# Altium schematic sheet MCU.SchDoc
size A2; SheetNumber: 2; SheetTotal: 10
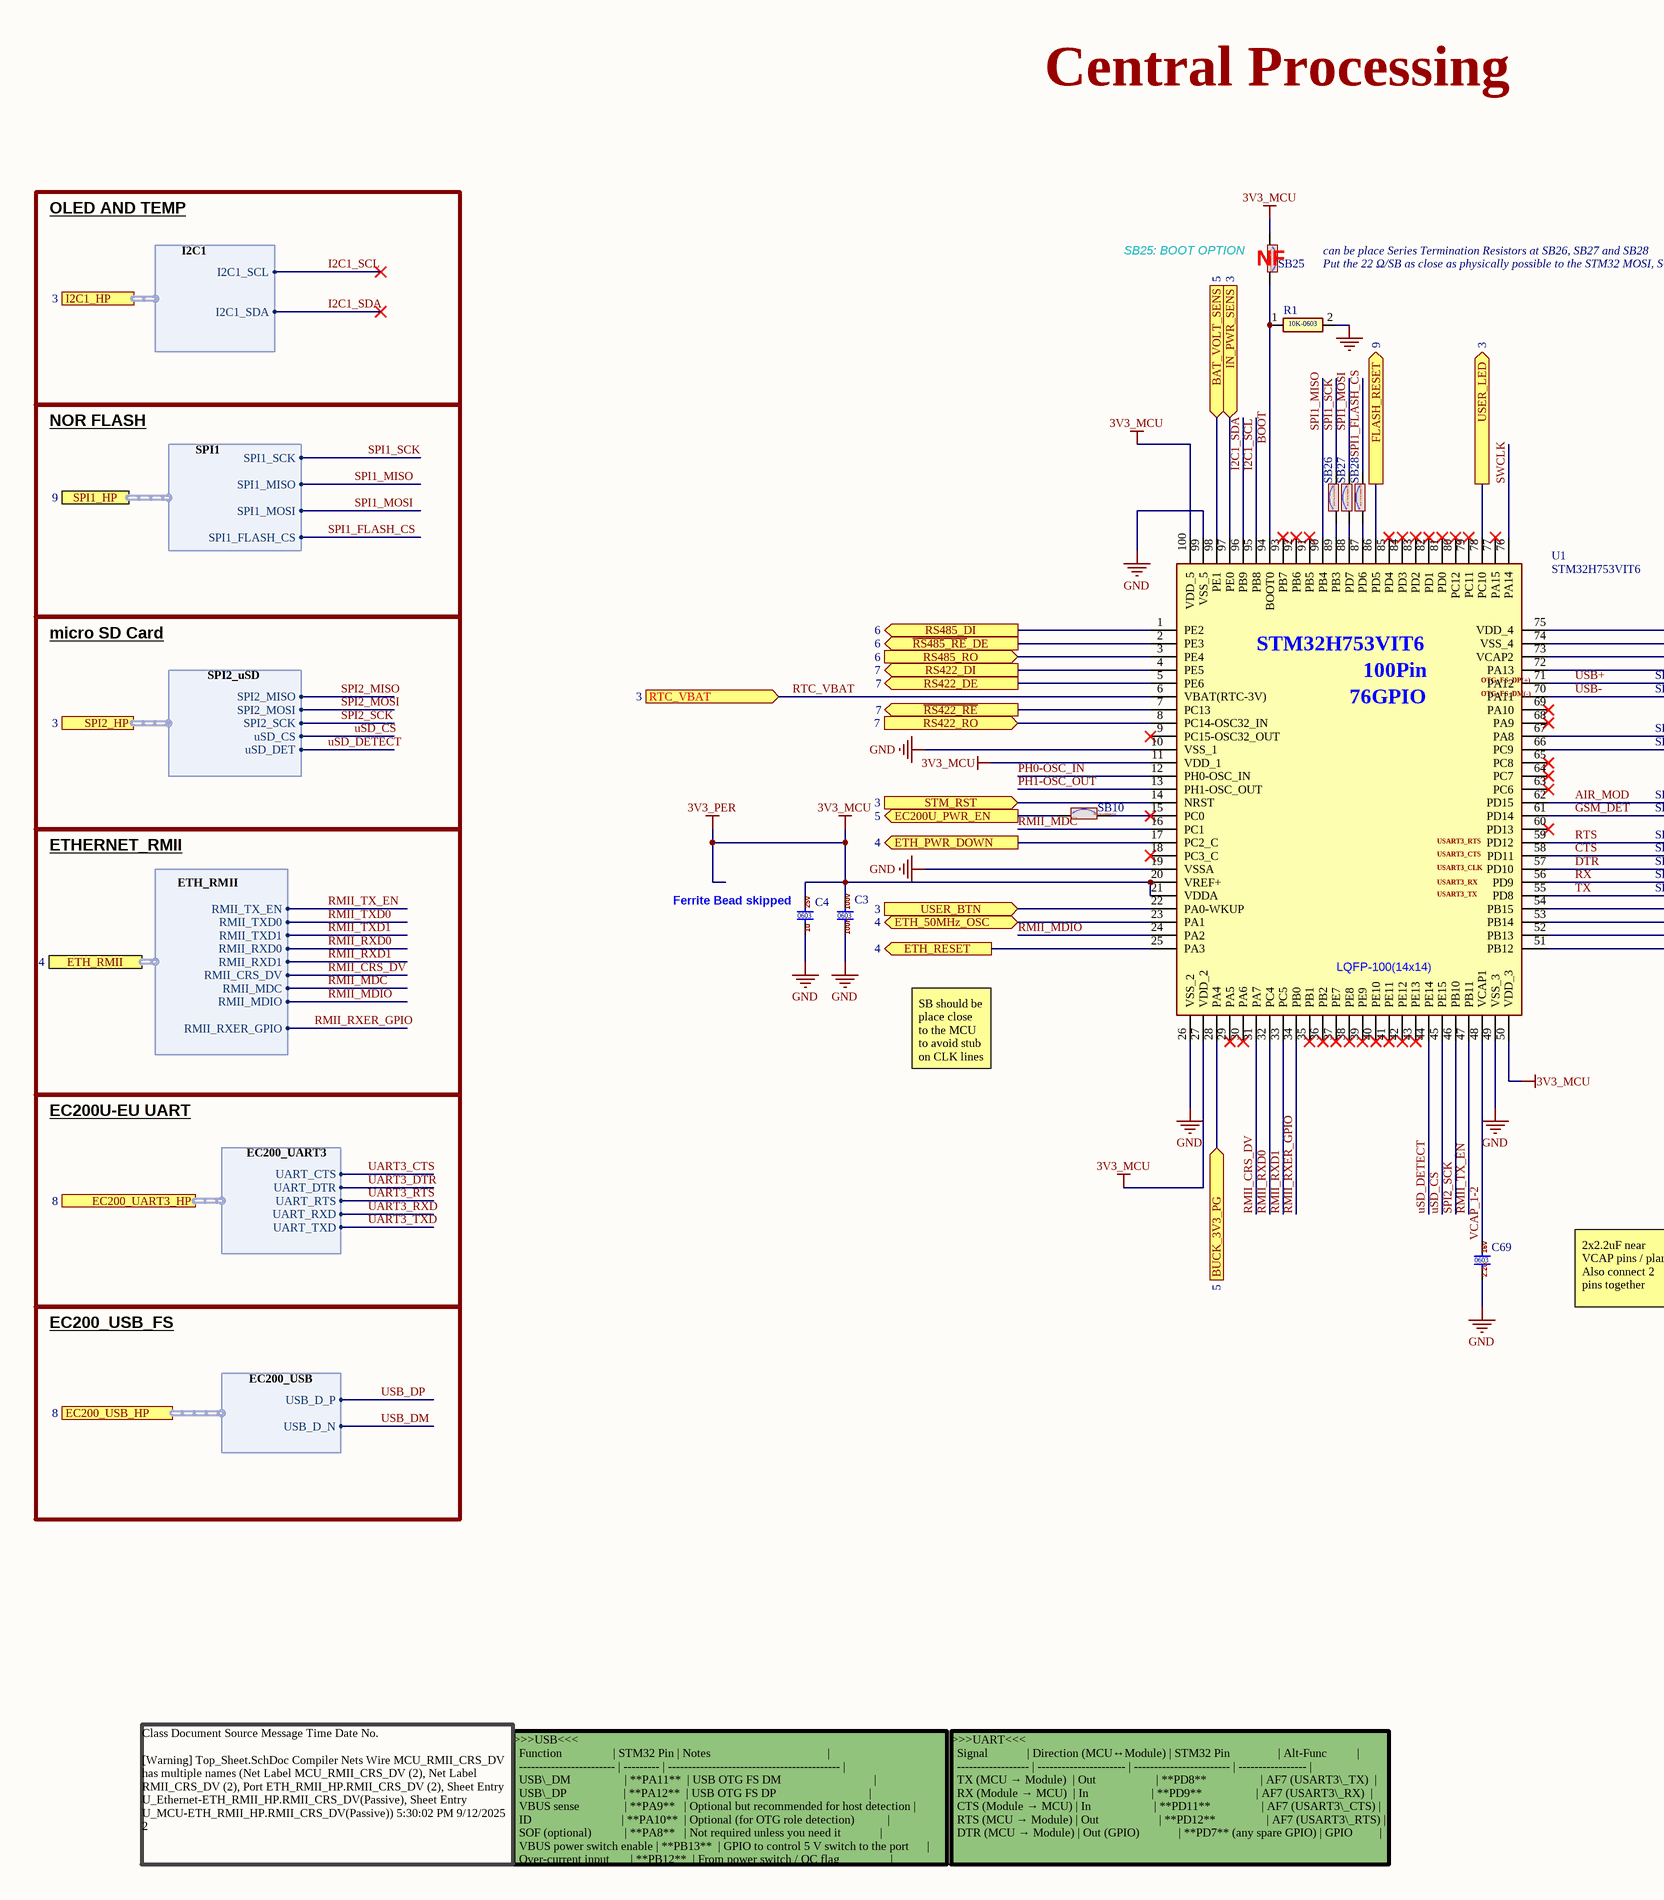
[diagram p0: MCU.SchDoc, left]
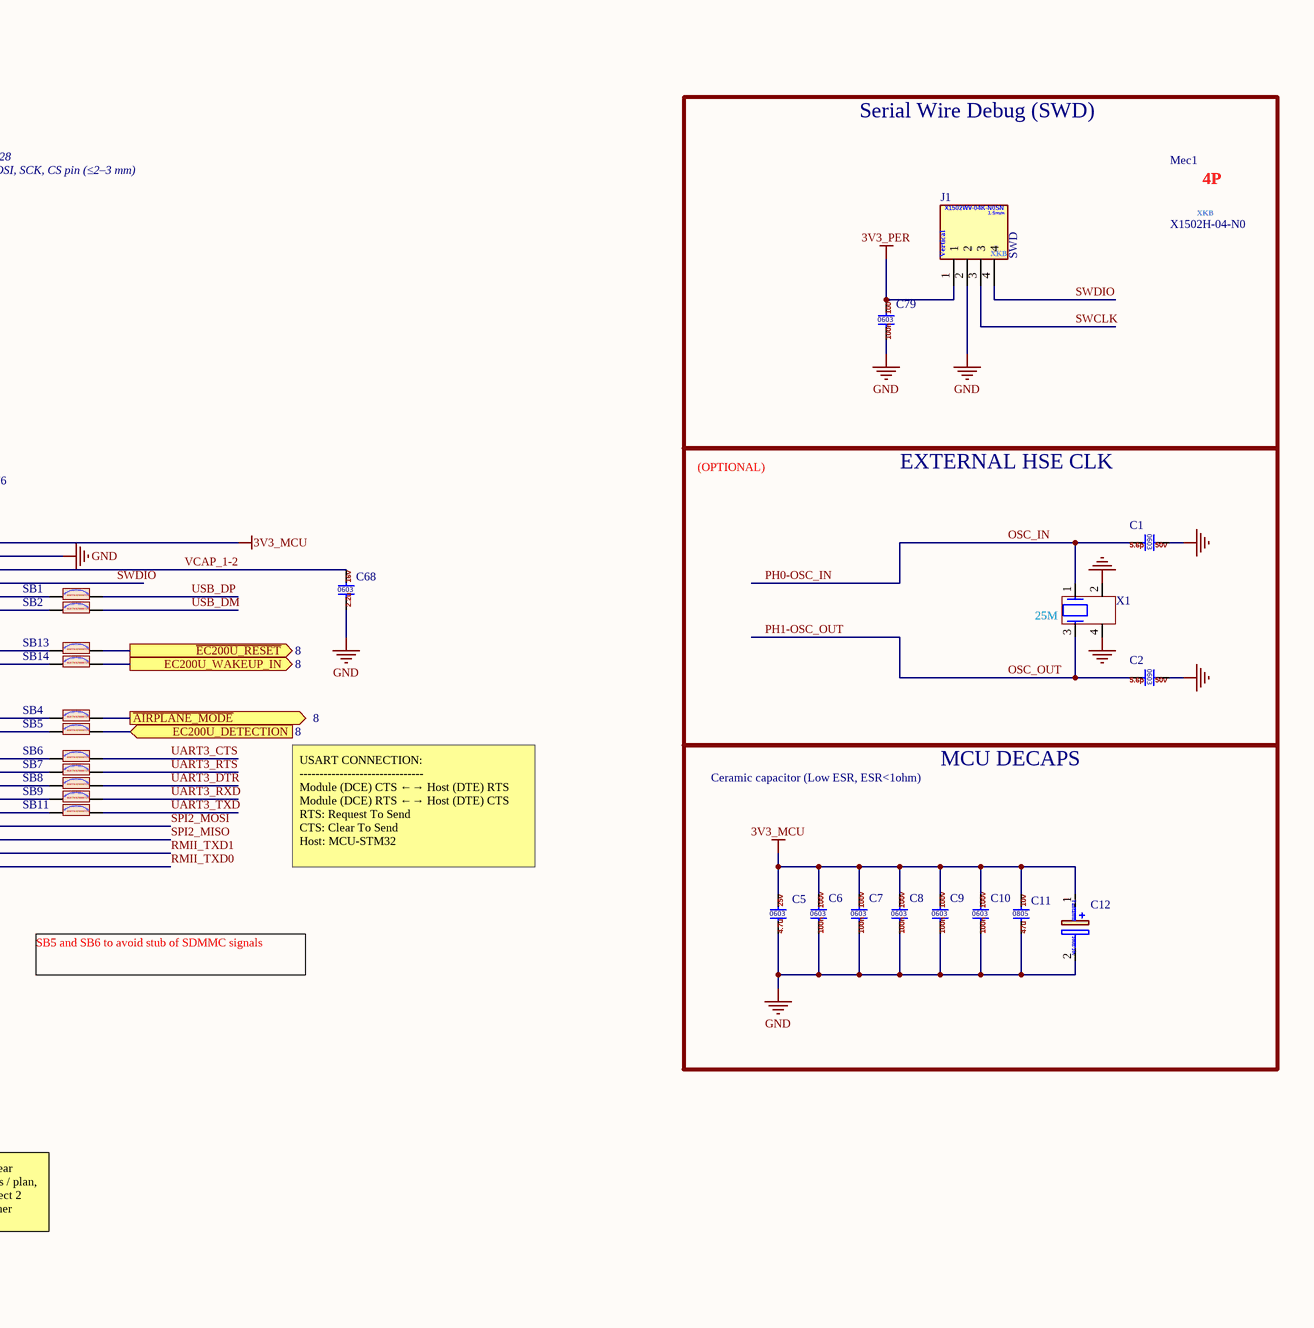
[diagram p1: MCU.SchDoc, right]

## Parts
C1  CL10C5R6CB8NNNC  [0603-CAP]  (value not drawn)
C2  CL10C5R6CB8NNNC  [0603-CAP]  (value not drawn)
C3  CL10B104KC8NNNC  [0603-CAP]  (value not drawn)
C4  CL10B105KA8NNNC  [0603-CAP]  (value not drawn)
C5  CL10A475KA8NQNC  [0603-CAP]  (value not drawn)
C6  CL10B104KC8NNNC  [0603-CAP]  (value not drawn)
C7  CL10B104KC8NNNC  [0603-CAP]  (value not drawn)
C8  CL10B104KC8NNNC  [0603-CAP]  (value not drawn)
C9  CL10B104KC8NNNC  [0603-CAP]  (value not drawn)
C10  CL10B104KC8NNNC  [0603-CAP]  (value not drawn)
C11  CL21A476MPYNNWE  [0805-CAP]  (value not drawn)
C12  TAJC107K010RNJ  [CASE-C-6032]  (value not drawn)
C68  CL10A225KO8NNNC  [0603-CAP]  (value not drawn)
C69  CL10A225KO8NNNC  [0603-CAP]  (value not drawn)
C79  CL10B104KC8NNNC  [0603-CAP]  (value not drawn)
J1  SWD  [JST 4P 1.5MM VERTICAL]
Mec1  X1502H-04-N0  (mechanical)
R1  0603WAF1002T5E  [0603-RES]  (value not drawn)
SB1  0603WAF0000T5E  [SOLDER-BRIDGE_R0603-0R]  (value not drawn)
SB2  0603WAF0000T5E  [SOLDER-BRIDGE_R0603-0R]  (value not drawn)
SB4  0603WAF0000T5E  [SOLDER-BRIDGE_R0603-0R]  (value not drawn)
SB5  0603WAF0000T5E  [SOLDER-BRIDGE_R0603-0R]  (value not drawn)
SB6  0603WAF0000T5E  [SOLDER-BRIDGE_R0603-0R]  (value not drawn)
SB7  0603WAF0000T5E  [SOLDER-BRIDGE_R0603-0R]  (value not drawn)
SB8  0603WAF0000T5E  [SOLDER-BRIDGE_R0603-0R]  (value not drawn)
SB9  0603WAF0000T5E  [SOLDER-BRIDGE_R0603-0R]  (value not drawn)
SB10  0603WAF0000T5E  [SOLDER-BRIDGE_R0603-0R]  (value not drawn)
SB11  0603WAF0000T5E  [SOLDER-BRIDGE_R0603-0R]  (value not drawn)
SB13  0603WAF0000T5E  [SOLDER-BRIDGE_R0603-0R]  (value not drawn)
SB14  0603WAF0000T5E  [SOLDER-BRIDGE_R0603-0R]  (value not drawn)
SB25  0603WAF0000T5E  [SOLDER-BRIDGE_R0603-0R]  (value not drawn)
SB26  0603WAF0000T5E  [SOLDER-BRIDGE_R0603-0R]  (value not drawn)
SB27  0603WAF0000T5E  [SOLDER-BRIDGE_R0603-0R]  (value not drawn)
SB28  0603WAF0000T5E  [SOLDER-BRIDGE_R0603-0R]  (value not drawn)
U1  STM32H753VIT6  [LQFP-100(14x14)]
X1  NX2016SA-25MHZ  [CRY_SMD2016-4P_NX2016SA]  (value not drawn)

## Blocks framed on the sheet
Serial Wire Debug (SWD): C79 J1 Mec1
EXTERNAL HSE CLK: C1 C2 X1
MCU DECAPS: C5-C12

## Ports
BAT_VOLT_SENS (in, see 5), BUCK_3V3_PG (in, see 5), EC200_UART3_HP (harness EC200_UART3, see 8), EC200_USB_HP (harness EC200_USB, see 8), EC200U_DETECTION (in, see 8), EC200U_PWR_EN (out, see 5), EC200U_WAKEUP_IN (out, see 8), ETH_50MHz_OSC (bidir, see 4), ETH_PWR_DOWN (out, see 4), ETH_RESET (out, see 4), ETH_RMII (harness ETH_RMII, see 4), FLASH_RESET (out, see 9), I2C1_HP (harness I2C1, see 3), IN_PWR_SENS (in, see 3), RS422_DE (out, see 7), RS422_DI (out, see 7), RS422_RO (in, see 7), RS485_DI (out, see 6), RS485_RO (in, see 6), RTC_VBAT (in, see 3), SPI1_HP (harness SPI1, see 9), SPI2_HP (harness SPI2_uSD, see 3), STM_RST (in, see 3), USER_BTN (in, see 3), USER_LED (out, see 3), ~{AIRPLANE_MODE} (out, see 8), ~{EC200U_RESET} (out, see 8), ~{RS422_RE} (out, see 7), ~{RS485_RE}_DE (out, see 6)

## Harnesses
SPI1: SPI1_SCK, SPI1_MISO, SPI1_MOSI, SPI1_FLASH_CS
I2C1: I2C1_SCL, I2C1_SDA
SPI2_uSD: uSD_CS, SPI2_MISO, SPI2_MOSI, SPI2_SCK, uSD_DET
EC200_UART3: UART_CTS, UART_DTR, UART_RTS, UART_RXD, UART_TXD
EC200_USB: USB_D_P, USB_D_N
ETH_RMII: RMII_TX_EN, RMII_TXD0, RMII_TXD1, RMII_RXD0, RMII_RXD1, RMII_CRS_DV, RMII_RXER_GPIO, RMII_MDC, RMII_MDIO

## Nets
3V3_MCU: C3.2 C4.2 C5.2 C6.2 C7.2 C8.2 C9.2 C10.2 C11.2 C12.1(+) C79.2 J1.1 SB25.1 U1.11(VDD_1) U1.20(VREF+) U1.21(VDDA) U1.27(VDD_2) U1.50(VDD_3) U1.75(VDD_4) U1.100(VDD_5)  [also labelled 3V3_PER]
GND: C1.2 C2.2 C3.1 C4.1 C5.1 C6.1 C7.1 C8.1 C9.1 C10.1 C11.1 C12.2(-) C68.1 C69.1 C79.1 J1.2 R1.2 U1.10(VSS_1) U1.19(VSSA) U1.26(VSS_2) U1.49(VSS_3) U1.74(VSS_4) U1.99(VSS_5) X1.2 X1.4
~{AIRPLANE_MODE}: SB4.2 ; port ~{AIRPLANE_MODE}
AIR_MOD: SB4.1 U1.62(PD15)
BAT_VOLT_SENS: U1.98(PE1) ; port BAT_VOLT_SENS
BOOT: R1.1 SB25.2 U1.94(BOOT0)
BUCK_3V3_PG: U1.28(PA4) ; port BUCK_3V3_PG
CTS: SB7.1 U1.58(PD11)
DTR: SB8.1 U1.57(PD10)
~{EC200U_RESET}: SB13.2 ; port ~{EC200U_RESET}
EC200U_DETECTION: SB5.2 ; port EC200U_DETECTION
EC200U_PWR_EN: SB10.2 ; port EC200U_PWR_EN
EC200U_WAKEUP_IN: SB14.2 ; port EC200U_WAKEUP_IN
ETH_50MHz_OSC: U1.23(PA1) ; port ETH_50MHz_OSC
ETH_PWR_DOWN: U1.17(PC2_C) ; port ETH_PWR_DOWN
ETH_RESET: U1.25(PA3) ; port ETH_RESET
FLASH_RESET: U1.86(PD5) ; port FLASH_RESET
GSM_DET: SB5.1 U1.61(PD14)
I2C1_SCL: U1.95(PB8) ; port I2C1_HP.I2C1_SCL
I2C1_SDA: U1.96(PB9) ; port I2C1_HP.I2C1_SDA
IN_PWR_SENS: U1.97(PE0) ; port IN_PWR_SENS
OSC_IN: C1.1 U1.12(PH0-OSC_IN) X1.1  [also labelled PH0-OSC_IN]
OSC_OUT: C2.1 U1.13(PH1-OSC_OUT) X1.3  [also labelled PH1-OSC_OUT]
~{RS422_RE}: U1.7(PC13) ; port ~{RS422_RE}
~{RS485_RE}_DE: U1.2(PE3) ; port ~{RS485_RE}_DE
RMII_CRS_DV: U1.31(PA7) ; port ETH_RMII.RMII_CRS_DV
RMII_MDC: U1.16(PC1) ; port ETH_RMII.RMII_MDC
RMII_MDIO: U1.24(PA2) ; port ETH_RMII.RMII_MDIO
RMII_RXD0: U1.32(PC4) ; port ETH_RMII.RMII_RXD0
RMII_RXD1: U1.33(PC5) ; port ETH_RMII.RMII_RXD1
RMII_RXER_GPIO: U1.34(PB0) ; port ETH_RMII.RMII_RXER_GPIO
RMII_TX_EN: U1.47(PB11) ; port ETH_RMII.RMII_TX_EN
RMII_TXD0: U1.51(PB12) ; port ETH_RMII.RMII_TXD0
RMII_TXD1: U1.52(PB13) ; port ETH_RMII.RMII_TXD1
RS422_DE: U1.5(PE6) ; port RS422_DE
RS422_DI: U1.4(PE5) ; port RS422_DI
RS422_RO: U1.8(PC14-OSC32_IN) ; port RS422_RO
RS485_DI: U1.1(PE2) ; port RS485_DI
RS485_RO: U1.3(PE4) ; port RS485_RO
RTC_VBAT: U1.6(VBAT(RTC-3V)) ; port RTC_VBAT
RTS: SB6.1 U1.59(PD12)
RX: SB9.1 U1.56(PD9)
SPI1_FLASH_CS: SB28.2 ; port SPI1_HP.SPI1_FLASH_CS
SPI1_MISO: U1.90(PB4) ; port SPI1_HP.SPI1_MISO
SPI1_MOSI: SB27.2 ; port SPI1_HP.SPI1_MOSI
SPI1_SCK: SB26.2 ; port SPI1_HP.SPI1_SCK
SPI2_MISO: U1.53(PB14) ; port SPI2_HP.SPI2_MISO
SPI2_MOSI: U1.54(PB15) ; port SPI2_HP.SPI2_MOSI
SPI2_SCK: U1.46(PB10) ; port SPI2_HP.SPI2_SCK
STM_RST: U1.14(NRST) ; port STM_RST
SWCLK: J1.3 U1.76(PA14)
SWDIO: J1.4 U1.72(PA13)
TX: SB11.1 U1.55(PD8)
UART3_CTS: SB6.2 ; port EC200_UART3_HP.UART_CTS
UART3_DTR: SB8.2 ; port EC200_UART3_HP.UART_DTR
UART3_RTS: SB7.2 ; port EC200_UART3_HP.UART_RTS
UART3_RXD: SB9.2 ; port EC200_UART3_HP.UART_RXD
UART3_TXD: SB11.2 ; port EC200_UART3_HP.UART_TXD
USB+: SB1.1 U1.71(PA12)
USB-: SB2.1 U1.70(PA11)
USB_DM: SB2.2 ; port EC200_USB_HP.USB_D_N
USB_DP: SB1.2 ; port EC200_USB_HP.USB_D_P
uSD_CS: U1.45(PE15) ; port SPI2_HP.uSD_CS
uSD_DETECT: U1.44(PE14) ; port SPI2_HP.uSD_DET
USER_BTN: U1.22(PA0-WKUP) ; port USER_BTN
USER_LED: U1.78(PC10) ; port USER_LED
VCAP_1-2: C68.2 C69.2 U1.48(VCAP1) U1.73(VCAP2)
NetSB10_1: SB10.1 U1.15(PC0)
NetSB13_1: SB13.1 U1.67(PA8)
NetSB14_1: SB14.1 U1.66(PC9)
NetSB26_1: SB26.1 U1.89(PB3)
NetSB27_1: SB27.1 U1.88(PD7)
NetSB28_1: SB28.1 U1.87(PD6)

Not connected (* = marked no-connect by the designer): U1 9(PC15-OSC32_OUT)* 18(PC3_C)* 29(PA5)* 30(PA6)* 35(PB1)* 36(PB2)* 37(PE7)* 38(PE8)* 39(PE9)* 40(PE10)* 41(PE11)* 42(PE12)* 43(PE13)* 60(PD13)* 63(PC6)* 64(PC7)* 65(PC8)* 68(PA9)* 69(PA10)* 77(PA15)* 79(PC11)* 80(PC12)* 81(PD0)* 82(PD1)* 83(PD2)* 84(PD3)* 85(PD4)* 91(PB5)* 92(PB6)* 93(PB7)*

## Notes on the sheet
- Central Processing
- OLED AND TEMP
- (near SB25) SB25: BOOT OPTION
- (near SB25) NF
- can be place Series Termination Resistors at SB26, SB27 and SB28
- Put the 22 Ω/SB as close as physically possible to the STM32 MOSI, SCK, CS pin (≤2–3 mm)
- NOR FLASH
- (OPTIONAL)
- micro SD Card
- (near U1) OTG_FS_DP(+)
- (near U1) OTG_FS_DM(-)
- (near X1) 25M
- ETHERNET_RMII
- (near U1) USART3_RX
- (near U1) USART3_CLK
- (near U1) USART3_CTS
- (near U1) USART3_RTS
- Ceramic capacitor (Low ESR, ESR<1ohm)
- (near C4) Ferrite Bead skipped
- (near U1) USART3_TX
- USART CONNECTION:
  -------------------------------
  Module (DCE) CTS ←→ Host (DTE) RTS
  Module (DCE) RTS ←→ Host (DTE) CTS
  RTS: Request To Send
  CTS: Clear To Send
  Host: MCU-STM32
- SB should be place close to the MCU to avoid stub on CLK lines
- SB5 and SB6 to avoid stub of SDMMC signals
- EC200U-EU UART
- EC200_USB_FS
- 2x2.2uF near VCAP pins / plan,
  Also connect 2 pins together
- Class	Document	Source	Message	Time	Date	No.
  [Warning]	Top_Sheet.SchDoc	Compiler	Nets Wire MCU_RMII_CRS_DV has multiple names (Net Label MCU_RMII_CRS_DV (2), Net Label RMII_CRS_DV (2), Port ETH_RMII_HP.RMII_CRS_DV (2), Sheet Entry U_Ethernet-ETH_RMII_HP.RMII_CRS_DV(Passive), Sheet Entry U_MCU-ETH_RMII_HP.RMII_CRS_DV(Passive))	5:30:02 PM	9/12/2025	2
- >>>USB<<<
  | Function                 | STM32 Pin | Notes                                       |
  | ------------------------ | --------- | ------------------------------------------- |
  | USB\_DM                  | **PA11**  | USB OTG FS DM                               |
  | USB\_DP                   | **PA12**  | USB OTG FS DP                               |
  | VBUS sense               | **PA9**   | Optional but recommended for host detection |
  | ID                              | **PA10**  | Optional (for OTG role detection)           |
  | SOF (optional)           | **PA8**   | Not required unless you need it             |
  | VBUS power switch enable | **PB13**  | GPIO to control 5 V switch to the port      |
  | Over-current input       | **PB12**  | From power switch / OC flag                 |
- >>>UART<<<
  | Signal             | Direction (MCU↔Module) | STM32 Pin                | Alt-Func          |
  | ------------------ | ---------------------- | ------------------------ | ----------------- |
  | TX (MCU → Module)  | Out                    | **PD8**                  | AF7 (USART3\_TX)  |
  | RX (Module → MCU)  | In                     | **PD9**                  | AF7 (USART3\_RX)  |
  | CTS (Module → MCU) | In                     | **PD11**                 | AF7 (USART3\_CTS) |
  | RTS (MCU → Module) | Out                    | **PD12**                 | AF7 (USART3\_RTS) |
  | DTR (MCU → Module) | Out (GPIO)             | **PD7** (any spare GPIO) | GPIO         |
- (in symbol 0603WAF1002T5E) 10K-0603
- (in symbol CL10A225KO8NNNC) 16v; 0603; 2.2u
- (in symbol CL10A475KA8NQNC) 25v; 0603; 4.7u
- (in symbol CL10B104KC8NNNC) 100v; 0603; 100n
- (in symbol CL10B105KA8NNNC) 25v; 0603; 1u
- (in symbol CL10C5R6CB8NNNC) 0603; 5.6p; 50v
- (in symbol CL21A476MPYNNWE) 10v; 0805; 47u
- (in symbol STM32H753VIT6) 100Pin; 76GPIO; LQFP-100(14x14)
- (in symbol TAJC107K010RNJ) Tantalum; 100u/10v
- (in symbol X1502H-04-N0) 4P; XKB
- (in symbol X1502WV-04K-N0SN) 1.5mm; Vertical; XKB

## Library data of the parts
C1 C2 = CL10C5R6CB8NNNC: CAP: CER 5.6PF 50V C0G 0603; LCSC Part #: C318670; Unit Price: 0.0037; ComponentLink1Description: DS; ComponentLink1URL: https://www.lcsc.com/datasheet/C1663.pdf
C3 C6-C10 C79 = CL10B104KC8NNNC: CAP: CER 100NF 100V X7R 0603; POC Price: 0.006; LCSC Part #: C15725; Unit Price: 0.0036; ComponentLink1Description: DS; ComponentLink1URL: https://www.lcsc.com/datasheet/C15725.pdf
C4 = CL10B105KA8NNNC: CAP: CER 1UF 25V X7R 0603; LCSC Part #: C29936; Unit Price: 0.0027; ComponentLink1Description: DS; ComponentLink1URL: https://www.lcsc.com/datasheet/C29936.pdf
C5 = CL10A475KA8NQNC: CAP: CER 4.7UF 25V X5R 0603; POC Price: 0.0167; LCSC Part #: C69335; Unit Price: 0.009; ComponentLink1Description: DS; ComponentLink1URL: https://www.lcsc.com/datasheet/C69335.pdf
C11 = CL21A476MPYNNWE: CAP: CER 47UF 10V X5R 0805; POC Price: 0.1234; LCSC Part #: C5596752; Unit Price: 0.0651; ComponentLink1Description: DS; ComponentLink1URL: https://www.lcsc.com/datasheet/C5596752.pdf
C12 = TAJC107K010RNJ: CAP: TANT 100uF ±10% 10V CASE-C-6032; POC Price: 0.2633; LCSC Part #: C8649; Unit Price: 0.1376; ComponentLink1Description: DS; ComponentLink1URL: http://datasheets.avx.com/TAJ.pdf
C68 C69 = CL10A225KO8NNNC: CAP: CER 2.2UF 16V X5R 0603; POC Price: 0.0062; LCSC Part #: C23630; Unit Price: 0.0033; ComponentLink1Description: DS; ComponentLink1URL: https://www.lcsc.com/datasheet/C23630.pdf
J1 = X1502WV-04K-N0SN: JST: Vertical, P1.5mm TH, 4P, Wire To Board Connector, 1A (Housing: X1502H-04-N0 - C697055); POC Price: 0.0307; LCSC Part #: C561527; Unit Price: 0.0141; ComponentLink1Description: DS; ComponentLink1URL: https://www.lcsc.com/datasheet/C561527.pdf
Mec1 = X1502H-04-N0: JST Housing: P1.5mm, 4P, Wire To Board; POC Price: 0.0139; LCSC Part #: C697055; Unit Price: 0.0063; ComponentLink1Description: DS; ComponentLink1URL: https://www.lcsc.com/datasheet/C697055.pdf
R1 = 0603WAF1002T5E: RES: 10K OHM 1% 100mW 0603 75V; LCSC Part #: C25804; Unit Price: 0.0005; ComponentLink1Description: DS; ComponentLink1URL: https://www.lcsc.com/datasheet/C25804.pdf
SB1 SB2 SB4-SB11 SB13 SB14 SB25-SB28 = 0603WAF0000T5E: Solder Bridge: ON SB 0603; LCSC Part #: C21189; Unit Price: 0.0006; ComponentLink1Description: DS; ComponentLink1URL: https://www.lcsc.com/datasheet/C21189.pdf
U1 = STM32H753VIT6: MCU: 32-bit Arm Cortex-M7 480MHz MCUs, 2MB Flash, 1MB RAM, 46 com. and analog interfaces, crypto, LQFP-100(14x14); POC Price: 11.0179; LCSC Part #: C730206; Unit Price: 7.6492; ComponentLink1Description: DS; ComponentLink1URL: https://www.st.com/resource/en/datasheet/stm32h753vi.pdf
X1 = NX2016SA-25MHZ: CRYSTAL: SMD2016-4P Crystals ROHS 25MHz; POC Price: 0.3434; LCSC Part #: C843258; Unit Price: 0.1723; ComponentLink1Description: DS; ComponentLink1URL: https://www.lcsc.com/datasheet/C843258.pdf